# Altium project LMAT_AMT_MAG_V1.PrjPcb
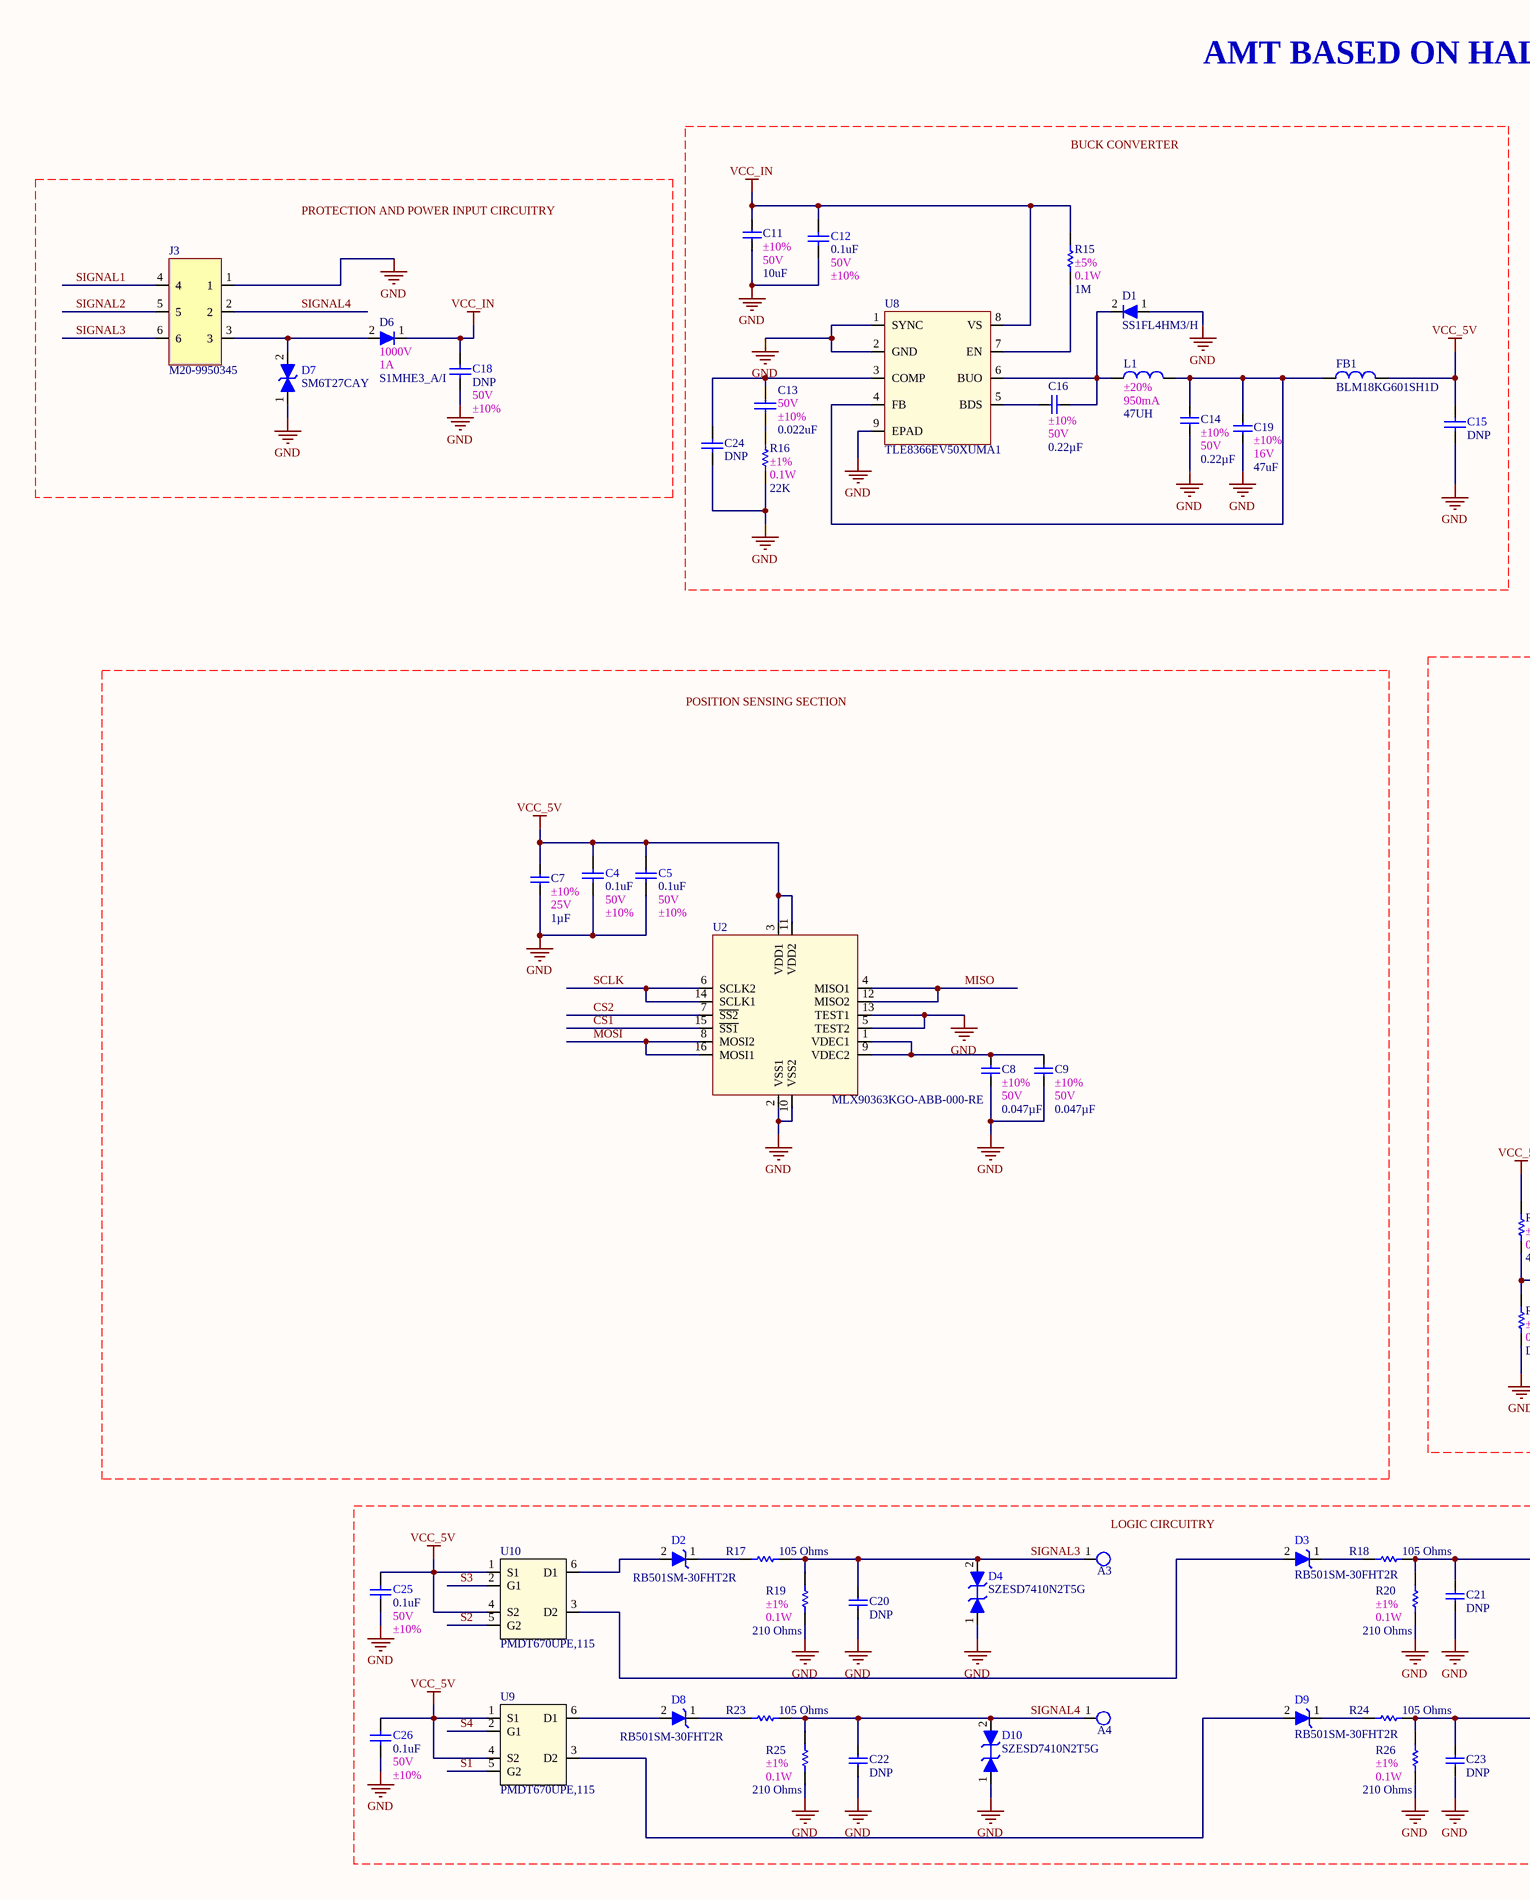
[diagram p0: LMAT_AMT_MAG__V1.SchDoc, left]
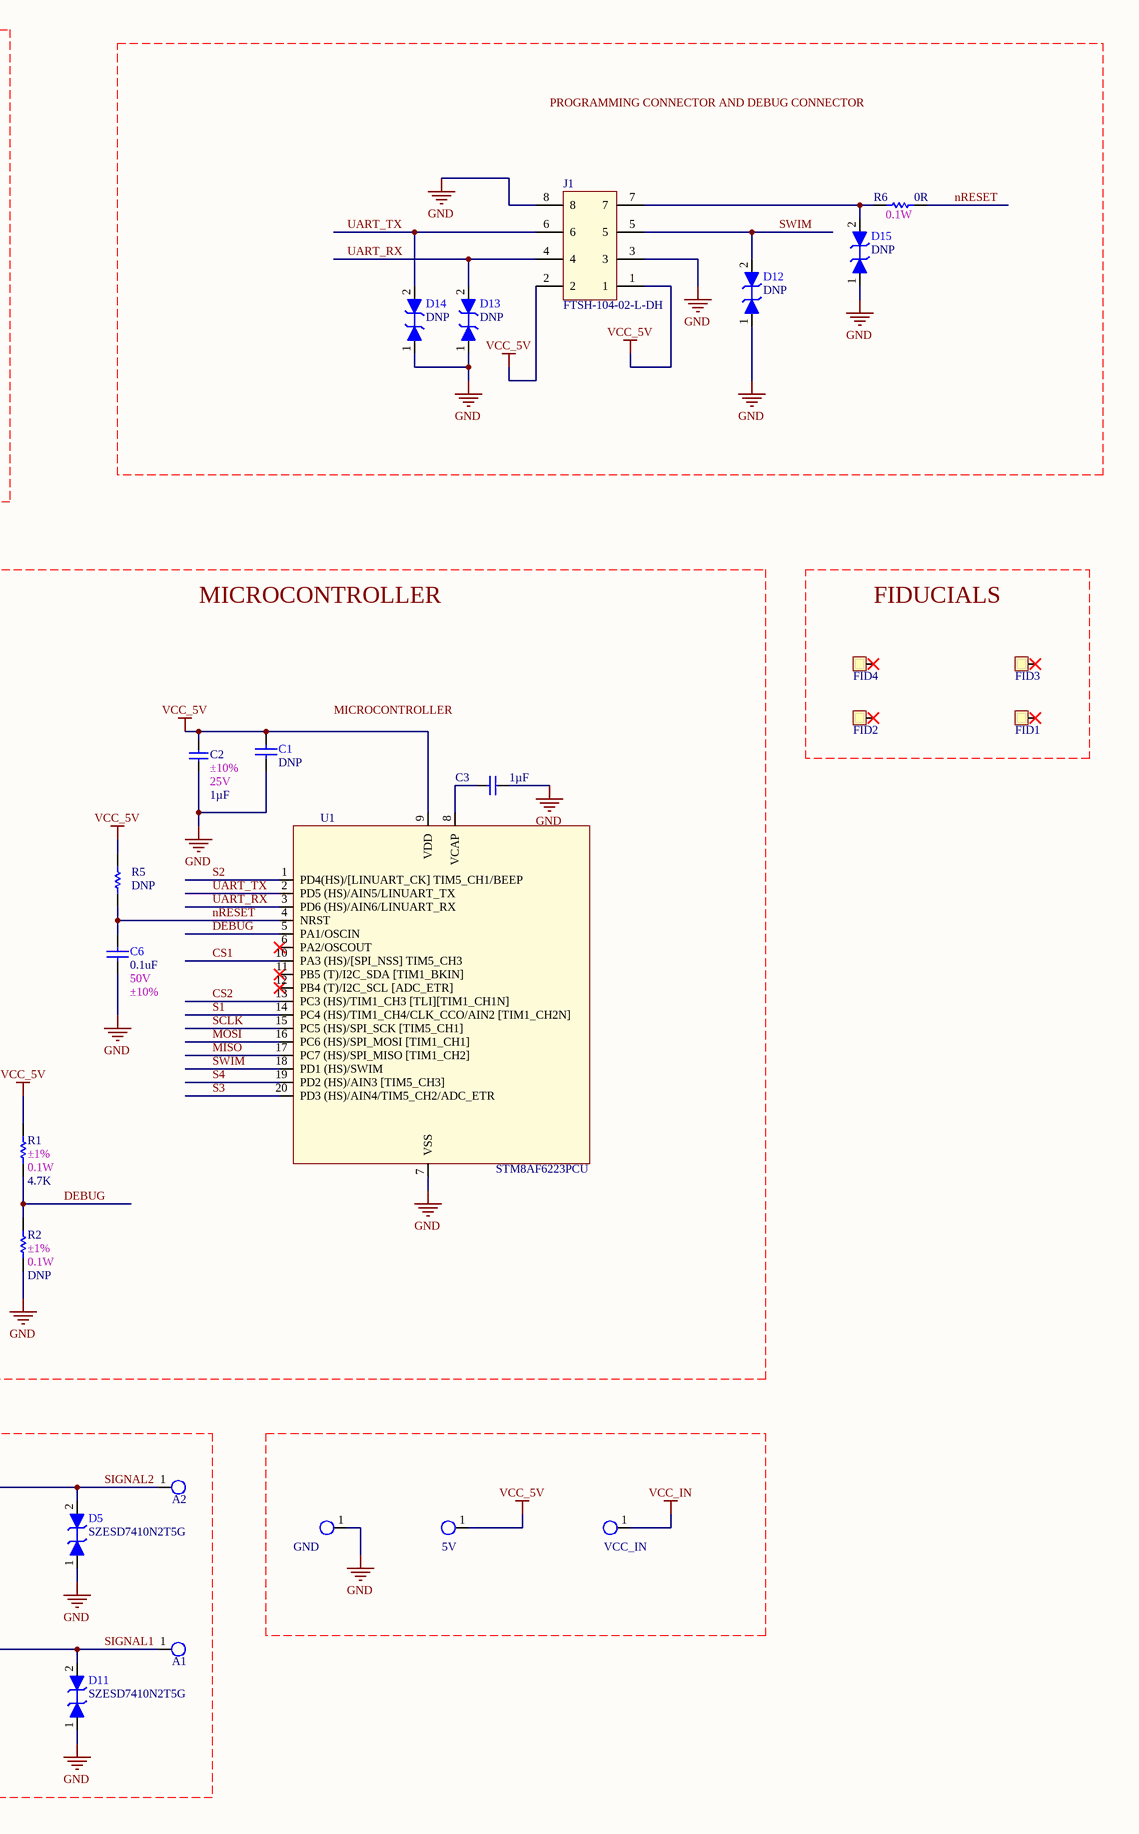
[diagram p1: LMAT_AMT_MAG__V1.SchDoc, right]
1 sheet, 73 parts. Net scope: global (net labels, ports and power ports of the same name join across sheets).
Board file: LMAT_AMT_MAG_V1.PcbDoc

## Sheet LMAT_AMT_MAG__V1.SchDoc
size C

### Parts
5V  Test Point- 35mil  [TP_35M_DIA]  (value not drawn)
A1  Test Point- 35mil  [TP_35M_DIA]  (value not drawn)
A2  Test Point- 35mil  [TP_35M_DIA]  (value not drawn)
A3  Test Point- 35mil  [TP_35M_DIA]  (value not drawn)
A4  Test Point- 35mil  [TP_35M_DIA]  (value not drawn)
C1  value DNP  [SMDC0603]  (hidden comment: CAP CER 0.1UF 50V 10% X7R 0603)
C2  value 1µF  2nd Auxiliary Field: ±10%  1st Auxiliary Field: 25V  [SMDC0603]  (hidden comment: CAP CER 1UF 25V X7R 0603)
C3  value 1µF  [SMDC0603]  (hidden comment: CAP CER 1UF 25V X7R 0603)
C4  value 0.1uF  1st Auxiliary Field: 50V  2nd Auxiliary Field: ±10%  [SMDC0603]  (hidden comment: CAP CER 0.1UF 50V 10% X7R 0603)
C5  value 0.1uF  1st Auxiliary Field: 50V  2nd Auxiliary Field: ±10%  [SMDC0603]  (hidden comment: CAP CER 0.1UF 50V 10% X7R 0603)
C6  value 0.1uF  1st Auxiliary Field: 50V  2nd Auxiliary Field: ±10%  [SMDC0603]  (hidden comment: CAP CER 0.1UF 50V 10% X7R 0603)
C7  value 1µF  2nd Auxiliary Field: ±10%  1st Auxiliary Field: 25V  [SMDC0603]  (hidden comment: CAP CER 1UF 25V X7R 0603)
C8  value 0.047µF  2nd Auxiliary Field: ±10%  1st Auxiliary Field: 50V  [SMDC0603]  (hidden comment: CAP CER 0.047UF 50V X7R 0603)
C9  value 0.047µF  2nd Auxiliary Field: ±10%  1st Auxiliary Field: 50V  [SMDC0603]  (hidden comment: CAP CER 0.047UF 50V X7R 0603)
C11  value 10uF  2nd Auxiliary Field: ±10%  1st Auxiliary Field: 50V  [SMDC1210]  (hidden comment: CAP CER 10UF 50V X7R 1210)
C12  value 0.1uF  1st Auxiliary Field: 50V  2nd Auxiliary Field: ±10%  [SMDC0603]  (hidden comment: CAP CER 0.1UF 50V 10% X7R 0603)
C13  value 0.022uF  1st Auxiliary Field: 50V  2nd Auxiliary Field: ±10%  [SMDC0603]  (hidden comment: CAP CER 0.022UF 50V 10% X7R 0603)
C14  value 0.22µF  2nd Auxiliary Field: ±10%  1st Auxiliary Field: 50V  [SMDC0603]  (hidden comment: CAP CER 0.22UF 50V X7R 0603)
C15  value DNP  [SMDC0603]  (hidden comment: CAP CER 0.1UF 50V 10% X7R 0603)
C16  value 0.22µF  2nd Auxiliary Field: ±10%  1st Auxiliary Field: 50V  [SMDC0603]  (hidden comment: CAP CER 0.22UF 50V X7R 0603)
C18  value DNP  1st Auxiliary Field: 50V  2nd Auxiliary Field: ±10%  [SMDC0603]  (hidden comment: CAP CER 0.1UF 50V 10% X7R 0603)
C19  value 47uF  2nd Auxiliary Field: ±10%  1st Auxiliary Field: 16V  [SMDC1210]  (hidden comment: CAP CER 47UF 16V X6S 1210)
C20  value DNP  [SMDC0603]  (hidden comment: CAP CER 10000PF 50V X8R 0603)
C21  value DNP  [SMDC0603]  (hidden comment: CAP CER 10000PF 50V X8R 0603)
C22  value DNP  [SMDC0603]  (hidden comment: CAP CER 10000PF 50V X8R 0603)
C23  value DNP  [SMDC0603]  (hidden comment: CAP CER 10000PF 50V X8R 0603)
C24  value DNP  [SMDC0603]  (hidden comment: CAP CER 0.022UF 50V 10% X7R 0603)
C25  value 0.1uF  1st Auxiliary Field: 50V  2nd Auxiliary Field: ±10%  [SMDC0603]  (hidden comment: CAP CER 0.1UF 50V 10% X7R 0603)
C26  value 0.1uF  1st Auxiliary Field: 50V  2nd Auxiliary Field: ±10%  [SMDC0603]  (hidden comment: CAP CER 0.1UF 50V 10% X7R 0603)
D1  value SS1FL4HM3/H  [SODFL370X110-2N]  (hidden comment: DIODE SCHOTTKY 40V 1A DO-219AB)
D2  value RB501SM-30FHT2R  [SOD1700X70N-V2]  (hidden comment: Diode Schottky 30V 100mA Surface Mount EMD2)
D3  value RB501SM-30FHT2R  [SOD1700X70N-V2]  (hidden comment: Diode Schottky 30V 100mA Surface Mount EMD2)
D4  value SZESD7410N2T5G  [DFN65P100X65X45-2N]  (hidden comment: TVS DIODE 5.5V 14V 2X1SON)
D5  value SZESD7410N2T5G  [DFN65P100X65X45-2N]  (hidden comment: TVS DIODE 5.5V 14V 2X1SON)
D6  value S1MHE3_A/I  1st Auxiliary Field: 1000V  2nd Auxiliary Field: 1A  [DIOM4227X23N-2N]  (hidden comment: DIODE GEN PURP 1KV 1A DO214AC)
D7  value SM6T27CAY  [DIOM4336X26B]  (hidden comment: TVS DIODE 23.1V 48.3V SMB)
D8  value RB501SM-30FHT2R  [SOD1700X70N-V2]  (hidden comment: Diode Schottky 30V 100mA Surface Mount EMD2)
D9  value RB501SM-30FHT2R  [SOD1700X70N-V2]  (hidden comment: Diode Schottky 30V 100mA Surface Mount EMD2)
D10  value SZESD7410N2T5G  [DFN65P100X65X45-2N]  (hidden comment: TVS DIODE 5.5V 14V 2X1SON)
D11  value SZESD7410N2T5G  [DFN65P100X65X45-2N]  (hidden comment: TVS DIODE 5.5V 14V 2X1SON)
D12  value DNP  [DFN65P100X65X45-2N]  (hidden comment: TVS DIODE 5.5V 14V 2X1SON)
D13  value DNP  [DFN65P100X65X45-2N]  (hidden comment: TVS DIODE 5.5V 14V 2X1SON)
D14  value DNP  [DFN65P100X65X45-2N]  (hidden comment: TVS DIODE 5.5V 14V 2X1SON)
D15  value DNP  [DFN65P100X65X45-2N]  (hidden comment: TVS DIODE 5.5V 14V 2X1SON)
FB1  value BLM18KG601SH1D  [SMDL0603]  (hidden comment: FERRITE BEAD 600 OHM 0603 1LN)
FID1  FID40X40  [FID40X40]  (value not drawn)
FID2  FID40X40  [FID40X40]  (value not drawn)
FID3  FID40X40  [FID40X40]  (value not drawn)
FID4  FID40X40  [FID40X40]  (value not drawn)
GND  Test Point- 35mil  [TP_35M_DIA]  (value not drawn)
J1  Manufacturer Part Number: FTSH-104-02-L-DH  [HDRRA8W53P127_2X4_9754X251X343P]  (hidden comment: CONN HEADER R/A 6POS 2.54MMCONN HEADER SMD R/A 8POS 1.27MM)
J3  Manufacturer Part Number: M20-9950345  [HDRRA6W86P254_2X3_1344X254X528P]  (hidden comment: CONN HEADER R/A 6POS 2.54MM)
L1  value 47UH  2nd Auxiliary Field: ±20%  1st Auxiliary Field: 950mA  [INDC4949X310N]  (hidden comment: FIXED IND 47UH 700MA 422.5 MOHM)
R1  value 4.7K  2nd Auxiliary Field: ±1%  1st Auxiliary Field: 0.1W  [SMDR0402]  (hidden comment: RES SMD 4.7K OHM 1% 1/10W 0402)
R2  value DNP  2nd Auxiliary Field: ±1%  1st Auxiliary Field: 0.1W  [SMDR0402]  (hidden comment: RES SMD 4.7K OHM 1% 1/10W 0402)
R5  value DNP  [SMDR0603]  (hidden comment: RES SMD 47K OHM 1% 1/10W 0603)
R6  value 0R  1st Auxiliary Field: 0.1W  [SMDR0603]  (hidden comment: RES SMD 0.0OHM JUMPER 1/10W 0603)
R15  value 1M  2nd Auxiliary Field: ±5%  1st Auxiliary Field: 0.1W  [SMDR0603]  (hidden comment: RES SMD 1M OHM 5% 1/10W 0603)
R16  value 22K  2nd Auxiliary Field: ±1%  1st Auxiliary Field: 0.1W  [SMDR0603]  (hidden comment: RES SMD 22K OHM 1% 1/10W 0603)
R17  value 105 Ohms  [SMDR0603]  (hidden comment: RES SMD 105 OHM 1% 1/10W 0603)
R18  value 105 Ohms  [SMDR0603]  (hidden comment: RES SMD 105 OHM 1% 1/10W 0603)
R19  value 210 Ohms  2nd Auxiliary Field: ±1%  1st Auxiliary Field: 0.1W  [SMDR0603]  (hidden comment: RES SMD 210 OHM 1% 1/10W 0603)
R20  value 210 Ohms  2nd Auxiliary Field: ±1%  1st Auxiliary Field: 0.1W  [SMDR0603]  (hidden comment: RES SMD 210 OHM 1% 1/10W 0603)
R23  value 105 Ohms  [SMDR0603]  (hidden comment: RES SMD 105 OHM 1% 1/10W 0603)
R24  value 105 Ohms  [SMDR0603]  (hidden comment: RES SMD 105 OHM 1% 1/10W 0603)
R25  value 210 Ohms  2nd Auxiliary Field: ±1%  1st Auxiliary Field: 0.1W  [SMDR0603]  (hidden comment: RES SMD 210 OHM 1% 1/10W 0603)
R26  value 210 Ohms  2nd Auxiliary Field: ±1%  1st Auxiliary Field: 0.1W  [SMDR0603]  (hidden comment: RES SMD 210 OHM 1% 1/10W 0603)
U1  value STM8AF6223PCU  [SOP65P640X120-20N]  (hidden comment: IC MCU 8BIT 8KB FLASH 20TSSOP)
U2  value MLX90363KGO-ABB-000-RE  [SOP65P640X120-16N]  (hidden comment: SENSOR HALL EFFECT SPI 16TSSOP)
U8  value TLE8366EV50XUMA1  [SOIC127P600X170_HS-9N]  (hidden comment: IC REG BUCK 5V 1.8A 8DSO)
U9  value PMDT670UPE,115  [SOTFL50P160X60-6N]  (hidden comment: MOSFET 2P-CH 20V 0.55A SOT666)
U10  value PMDT670UPE,115  [SOTFL50P160X60-6N]  (hidden comment: MOSFET 2P-CH 20V 0.55A SOT666)
VCC_IN  Test Point- 35mil  [TP_35M_DIA]  (value not drawn)

### Nets
GND: C1.2 C2.1 C3.2 C4.2 C5.2 C6.2 C7.1 C8.1 C9.1 C11.1 C12.2 C14.1 C15.2 C18.2 C19.1 C20.1 C21.1 C22.1 C23.1 C24.2 C25.2 C26.2 D1.1(Cathode) D4.1(ANODE) D5.1(ANODE) D7.1(ANODE) D10.1(ANODE) D11.1(ANODE) D12.1(ANODE) D13.1(ANODE) D14.1(ANODE) D15.1(ANODE) GND.1 J1.3 J1.8 J3.1 R2.1 R16.1 R19.2 R20.2 R25.2 R26.2 U1.7(VSS) U2.2(VSS1) U2.5(TEST2) U2.10(VSS2) U2.13(TEST1) U8.1(SYNC) U8.2(GND) U8.9(EPAD)
VCC_5V: 5V.1 C1.1 C2.2 C4.1 C5.1 C7.2 C15.1 C25.1 C26.1 FB1.2 J1.1 J1.2 R1.2 R5.2 U1.9(VDD) U2.3(VDD1) U2.11(VDD2) U9.1(S1) U9.4(S2) U10.1(S1) U10.4(S2)
VCC_IN: C11.2 C12.1 C18.1 D6.1(Cathode) R15.2 U8.8(VS) VCC_IN.1
CS1: U1.10(PA3_(HS)/[SPI_NSS]_TIM5_CH3) U2.15(~{SS1})
CS2: U1.13(PC3_(HS)/TIM1_CH3_[TLI][TIM1_CH1N]) U2.7(~{SS2})
DEBUG: R1.1 R2.2 U1.5(PA1/OSCIN)
MISO: U1.17(PC7_(HS)/SPI_MISO_[TIM1_CH2]) U2.4(MISO1) U2.12(MISO2)
MOSI: U1.16(PC6_(HS)/SPI_MOSI_[TIM1_CH1]) U2.8(MOSI2) U2.16(MOSI1)
nRESET: C6.1 R5.1 R6.2 U1.4(NRST)
S1: U1.14(PC4_(HS)/TIM1_CH4/CLK_CCO/AIN2_[TIM1_CH2N]) U9.5(G2)
S2: U1.1(PD4(HS)/[LINUART_CK]_TIM5_CH1/BEEP) U10.5(G2)
S3: U1.20(PD3_(HS)/AIN4/TIM5_CH2/ADC_ETR) U10.2(G1)
S4: U1.19(PD2_(HS)/AIN3_[TIM5_CH3]) U9.2(G1)
SCLK: U1.15(PC5_(HS)/SPI_SCK_[TIM5_CH1]) U2.6(SCLK2) U2.14(SCLK1)
SIGNAL1: A1.1 C23.2 D11.2(CATHODE) J3.4 R24.2 R26.1
SIGNAL2: A2.1 C21.2 D5.2(CATHODE) J3.5 R18.2 R20.1
SIGNAL3: A3.1 C20.2 D4.2(CATHODE) J3.6 R17.2 R19.1
SIGNAL4: A4.1 C22.2 D10.2(CATHODE) J3.2 R23.2 R25.1
SWIM: D12.2(CATHODE) J1.5 U1.18(PD1_(HS)/SWIM)
UART_RX: D13.2(CATHODE) J1.4 U1.3(PD6_(HS)/AIN6/LINUART_RX)
UART_TX: D14.2(CATHODE) J1.6 U1.2(PD5_(HS)/AIN5/LINUART_TX)
NetC3_1: C3.1 U1.8(VCAP)
NetC8_2: C8.2 C9.2 U2.1(VDEC1) U2.9(VDEC2)
NetC13_1: C13.1 C24.1 U8.3(COMP)
NetC13_2: C13.2 R16.2
NetC14_2: C14.2 C19.2 FB1.1 L1.2 U8.4(FB)
NetC16_1: C16.1 U8.5(BDS)
NetC16_2: C16.2 D1.2(Anode) L1.1 U8.6(BUO)
NetD2_1: D2.1(CATHODE) R17.1
NetD2_2: D2.2(ANODE) U10.6(D1)
NetD3_1: D3.1(CATHODE) R18.1
NetD3_2: D3.2(ANODE) U10.3(D2)
NetD6_2: D6.2(Anode) D7.2(CATHODE) J3.3
NetD8_1: D8.1(CATHODE) R23.1
NetD8_2: D8.2(ANODE) U9.6(D1)
NetD9_1: D9.1(CATHODE) R24.1
NetD9_2: D9.2(ANODE) U9.3(D2)
NetD15_2: D15.2(CATHODE) J1.7 R6.1
NetR15_1: R15.1 U8.7(EN)

Not connected (* = marked no-connect by the designer): FID1 0*; FID2 0*; FID3 0*; FID4 0*; U1 6(PA2/OSCOUT)* 11(PB5_(T)/I2C_SDA_[TIM1_BKIN])* 12(PB4_(T)/I2C_SCL_[ADC_ETR])*

### Notes on the sheet
- AMT BASED ON HALL EFFECT SENSOR
- BUCK CONVERTER
- PROTECTION AND POWER INPUT CIRCUITRY
- PROGRAMMING CONNECTOR AND DEBUG CONNECTOR
- MICROCONTROLLER
- FIDUCIALS
- POSITION SENSING SECTION
- (near A3) LOGIC CIRCUITRY

### Library data of the parts
5V A1-A4 GND VCC_IN = EMS-TP35MIL-S: Internal Part Number: EMS-TP35MIL-S; Component Height (mm): *; Part Type: Test Point- 35mil; Vendor Name: *
C1 C4-C6 C12 C15 C18 C25 C26 = ECA0U10K50V0-SC: Manufacturer Part Number: CGA3E2X7R1H104K080AA; Manufacturer: TDK Corporation; Vendor Part Number: 445-5666-1-ND; 3rd Auxiliary Field: RoHS Compliant; Component Height (mm): 0.90mm; Vendor Name: Digi-Key; Internal Part Number: ECA0U10K50V0-SC; Part Type: CAP CER 0.1UF 50V X7R 0603; Temp Co: X7R
  C1 C15: 1st Auxiliary Field: 50V; 2nd Auxiliary Field: ±10%
C2 C7 = ECA1U00L25V0-SC: Manufacturer: TDK Corporation; Vendor Part Number: 445-173628-1-ND; Manufacturer Part Number: CGA3E1X7R1E105K080AE; Vendor Name: Digi-Key; 3rd Auxiliary Field: RoHS Compliant; Component Height (mm): 0.95mm; Temp Co: -55°C ~ 125°C; Part Type: CAP CER 1UF 25V X7R 0603; Internal Part Number: ECA1U00L25V0-SC; 4th Auxiliary Field: *
C3 = ECA1U00L25V0-SC: Manufacturer: TDK Corporation; Vendor Part Number: 445-173628-1-ND; Manufacturer Part Number: CGA3E1X7R1E105K080AE; Vendor Name: Digi-Key; 3rd Auxiliary Field: RoHS Compliant; Component Height (mm): 0.95mm; Temp Co: -55°C ~ 125°C; 2nd Auxiliary Field: ±10%; Part Type: CAP CER 1UF 25V X7R 0603; Internal Part Number: ECA1U00L25V0-SC; 4th Auxiliary Field: *; 1st Auxiliary Field: 25V
C8 C9 = ECA47N0L50V-SC: Manufacturer: TDK Corporation; Vendor Part Number: 445-5664-1-ND; Manufacturer Part Number: CGA3E2X7R1H473K080AA; Vendor Name: Digi-Key; 3rd Auxiliary Field: RoHS Compliant; Component Height (mm): 0.9mm; Temp Co: -55°C ~ 125°C; Part Type: CAP CER 0.047UF 50V X7R 0603; Internal Part Number: ECA47N0L50V-SC; 4th Auxiliary Field: *
C11 = ECA10U0L50V0-SH: Manufacturer: Taiyo Yuden; Vendor Part Number: 587-6026-1-ND; Manufacturer Part Number: UMJ325KB7106KMHP; Vendor Name: Digi-Key; 3rd Auxiliary Field: RoHS Compliant; 4th Auxiliary Field: AEC-Q200; Component Height (mm): 2.80mm; Temp Co: -55°C ~ 125°C; Part Type: CAP CER 10UF 50V X7R 1210; Internal Part Number: ECA10U0L50V0-SH
C13 C24 = ECA0U022K50V0-SC: Manufacturer Part Number: CGA3E2X7R1H223K080AA; Manufacturer: TDK Corporation; Vendor Part Number: 445-5663-1-ND; Vendor Name: Digi-Key; Component Height (mm): 0.90mm; Internal Part Number: ECA0U022K50V0-SC; Part Type: CAP CER 0.022UF 50V X7R 0603; Temp Co: X7R
  C24: 1st Auxiliary Field: 50V; 2nd Auxiliary Field: ±10%
C14 C16 = ECA0U22L50V0-SC: Manufacturer: Murata Electronics North America; Vendor Part Number: 490-14410-1-ND; Manufacturer Part Number: GCJ188R71H224KA01D; Vendor Name: Digi-Key; 3rd Auxiliary Field: RoHS Compliant; Component Height (mm): 0.90mm; Temp Co: -55°C ~ 125°C; Part Type: CAP CER 0.22UF 50V X7R 0603; Internal Part Number: ECA0U22L50V0-SC; 4th Auxiliary Field: *
C19 = ECA47U0L16V0-SH: Manufacturer: Murata Electronics North America; Vendor Part Number: 490-12494-1-ND; Manufacturer Part Number: GRT32EC81C476KE13L; Vendor Name: Digi-Key; 3rd Auxiliary Field: RoHS Compliant; 4th Auxiliary Field: AEC-Q200; Component Height (mm): 2.70mm; Temp Co: -55°C ~ 105°C; Part Type: CAP CER 47UF 16V X6S 1210; Internal Part Number: ECA47U0L16V0-SH
C20-C23 = ECA0U01L50V0-SC: Manufacturer: TDK Corporation; Vendor Part Number: 445-5892-1-ND; Manufacturer Part Number: CGA3E2X8R1H103K080AA; Vendor Name: Digi-Key; 3rd Auxiliary Field: RoHS Compliant; 4th Auxiliary Field: AEC-Q200; Component Height (mm): 0.80mm; Temp Co: -55°C ~ 150°C; 2nd Auxiliary Field: ±10%; Part Type: CAP CER 10000PF 50V X8R 0603; Internal Part Number: ECA0U01L50V0-SC; 1st Auxiliary Field: 50V
D1 = EDDVS1A0040V0-S: Manufacturer: Vishay Semiconductor Diodes Division; Vendor Part Number: SS1FL4HM3/HGICT-ND; 3rd Auxiliary Field: RoHS Compliant; Temp Co: -55°C ~ 150°C; Vendor Name: Digi-Key; Component Height (mm): 1.08mm; Manufacturer Part Number: SS1FL4HM3/H; Internal Part Number: EDDVS1A0040V0-S; Part Type: DIODE SCHOTTKY 40V 1A DO-219AB; 4th Auxiliary Field: *; 1st Auxiliary Field: 40V; 2nd Auxiliary Field: 1A
D2 D3 D8 D9 = EDDR0A1030V0-S: Manufacturer: Rohm Semiconductor; Vendor Part Number: RB501SM-30FHT2RCT-ND; 3rd Auxiliary Field: RoHS Compliant; Component Height (mm): 0.70mm; Temp Co: 125°C (Max); Vendor Name: Digi-Key; Manufacturer Part Number: RB501SM-30FHT2R; Internal Part Number: EDDR0A1030V0-S; Part Type: Diode Schottky 30V 100mA Surface Mount EMD2; 4th Auxiliary Field: *; 2nd Auxiliary Field: 100mA; 1st Auxiliary Field: 30V
D4 D5 D10 D11 = EDDOS16A010V0-S: TVS DIODE 8V 20V 2X2DFN; Manufacturer: ON Semiconductor; Vendor Part Number: SZESD7410N2T5GOSCT-ND; 3rd Auxiliary Field: RoHS Compliant; Component Height (mm): 0.40mm; Temp Co: -55°C ~ 150°C (TJ); 4th Auxiliary Field: AEC-Q101; Vendor Name: Digi-Key; 2nd Auxiliary Field: 16A; 1st Auxiliary Field: 10V; Manufacturer Part Number: SZESD7410N2T5G; Internal Part Number: EDDOS16A010V0-S; Part Type: TVS DIODE 8V 20V 2X2DFN
D6 = EDDVS1A001000V-S: Manufacturer: Vishay Semiconductor Diodes Division; Vendor Part Number: S1MHE3_A/IGICT-ND; 3rd Auxiliary Field: RoHS Compliant; Temp Co: -55°C ~ 150°C; Vendor Name: Digi-Key; Component Height (mm): 2.29mm; Manufacturer Part Number: S1MHE3_A/I; Internal Part Number: EDDVS1A001000V-S; Part Type: DIODE GEN PURP 1KV 1A DO214AC; 4th Auxiliary Field: *
D7 = EDDST83A025V7-S: Manufacturer: STMicroelectronics; Vendor Part Number: 497-10798-1-ND; 3rd Auxiliary Field: RoHS Compliant; Component Height (mm): 2.65mm; Temp Co: -55°C ~ 150°C (TJ); Vendor Name: Digi-Key; 2nd Auxiliary Field: 600W; 1st Auxiliary Field: 25.7V; Manufacturer Part Number: SM6T27CAY; Internal Part Number: EDDST83A025V7-S; Part Type: TVS DIODE 23.1V 48.3V SMB; 4th Auxiliary Field: *
D12-D15 = EDDOS16A010V0-S: TVS DIODE 8V 20V 2X2DFN; Manufacturer Part Number: SZESD7410N2T5G; Manufacturer: ON Semiconductor; Vendor Part Number: SZESD7410N2T5GOSCT-ND; 3rd Auxiliary Field: RoHS Compliant; Component Height (mm): 0.40mm; Temp Co: -55°C ~ 150°C (TJ); 4th Auxiliary Field: AEC-Q101; Vendor Name: Digi-Key; 2nd Auxiliary Field: 16A; 1st Auxiliary Field: 10V; Internal Part Number: EDDOS16A010V0-S; Part Type: TVS DIODE 8V 20V 2X2DFN
FB1 = EIN600R1A30-S: Manufacturer: Murata Electronics North America; Vendor Part Number: 490-13259-1-ND; Vendor Name: Digi-Key; 3rd Auxiliary Field: RoHS Compliant; 4th Auxiliary Field: AEC-Q200; Component Height (mm): 0.95mm; Temp Co: -55°C ~ 125°C; 2nd Auxiliary Field: 1.3A; 1st Auxiliary Field: 150 mOhm; Part Type: FERRITE BEAD 600 OHM 0603 1LN; Manufacturer Part Number: BLM18KG601SH1D; Internal Part Number: EIN600R1A30-S
FID1-FID4 = FID_40X40
J1 = ECN-FTSH-104-02-L-DH-0005: CONN HEADER SMD R/A 8POS 1.27MM; Manufacturer: Samtec Inc.; Vendor Part Number: SAM11248-ND; 2nd Auxiliary Field: 2 rows; 3rd Auxiliary Field: RoHS Compliant; Component Height (mm): 3.43mm; Temp Co: -55°C ~ 125°C; Vendor Name: Digi-Key; 1st Auxiliary Field: 8POS; Internal Part Number: ECN-FTSH-104-02-L-DH-0005; Part Type: CONN HEADER SMD R/A 8POS 1.27MM; Value: FTSH-104-02-L-DH; 4th Auxiliary Field: *
J3 = ECN-M20-9950345-0003: Manufacturer: Harwin Inc.; Vendor Part Number: 952-2092-ND; 2nd Auxiliary Field: 2 rows; 3rd Auxiliary Field: RoHS Compliant; Component Height (mm): 5.08mm; Temp Co: -40°C ~ 105°C; Vendor Name: Digi-Key; 1st Auxiliary Field: 6pos; Internal Part Number: ECN-M20-9950345-0003; Part Type: CONN HEADER R/A 6POS 2.54MM; Value: M20-9950345; 4th Auxiliary Field: *
L1 = EIN47U0N950M-S: Manufacturer: Taiyo Yuden; Vendor Part Number: 587-3604-1-ND; Manufacturer Part Number: NRS5030T470MMGJV; Vendor Name: Digi-Key; 3rd Auxiliary Field: RoHS Compliant; 4th Auxiliary Field: AEC-Q200; Component Height (mm): 3.00mm; Temp Co: -40°C ~ 125°C; Part Type: FIXED IND 47UH 700MA 422.5 MOHM; Internal Part Number: EIN47U0N950M-S
R1 R2 = ERE4K70G110-SB: Manufacturer: Panasonic Electronic Components; Vendor Part Number: P4.70KLCT-ND; Manufacturer Part Number: ERJ-2RKF4701X; Alternate Part Number: RK73H1ETTP4701F; Vendor Name: Digi-Key; 3rd Auxiliary Field: RoHS Compliant; 4th Auxiliary Field: AEC-Q200; Component Height (mm): 0.40mm; Temp Co: ±100ppm/°C; Part Type: RES SMD 4.7K OHM 1% 1/10W 0402; Internal Part Number: ERE4K70G110-SB
R5 = ERE47K0G110-SC: Manufacturer: Yageo; Vendor Part Number: YAG2129CT-ND; Manufacturer Part Number: AT0603FRE0747KL; Vendor Name: Digi-Key; 3rd Auxiliary Field: RoHS Compliant; Component Height (mm): 0.55mm; Temp Co: -55°C ~ 155°C; 1st Auxiliary Field: 0.1W; Part Type: RES SMD 47K OHM 1% 1/10W 0603; Internal Part Number: ERE47K0G110-SC; 4th Auxiliary Field: *; 2nd Auxiliary Field: ±1%
R6 = ERE0R00110-SC: Manufacturer Part Number: ERJ-3GEY0R00V; Manufacturer: Panasonic Electronic Components; Vendor Part Number: P0.0GCT-ND; Component Height (mm): 0.55mm; Vendor Name: Digi-Key; Internal Part Number: ERE0R00110-SC; Part Type: RES SMD 0.0OHM JUMPER 1/10W 0603; Temp Co: *; 2nd Auxiliary Field: Jumper
R15 = ERE1M00K110-SC: Manufacturer: Vishay Dale; Vendor Part Number: 541-2216-1-ND; Manufacturer Part Number: RCA06031M00JNEA; Vendor Name: Digi-Key; 3rd Auxiliary Field: RoHS Compliant; 4th Auxiliary Field: AEC-Q200; Component Height (mm): 0.50mm; Temp Co: -55°C ~ 155°C; Part Type: RES SMD 1M OHM 5% 1/10W 0603; Internal Part Number: ERE1M00K110-SC
R16 = ERE22K0G110-SC: Manufacturer: Panasonic Electronic Components; Vendor Part Number: P22.0KHCT-ND; Manufacturer Part Number: ERJ-3EKF2202V; Vendor Name: Digi-Key; 3rd Auxiliary Field: RoHS Compliant; 4th Auxiliary Field: AEC-Q200; Component Height (mm): 0.55mm; Temp Co: -55°C ~ 155°C; Part Type: RES SMD 22K OHM 1% 1/10W 0603; Internal Part Number: ERE22K0G110-SC
R17 R18 R23 R24 = ERE105RG110-SC: Manufacturer: Panasonic Electronic Components; Vendor Part Number: P105HCT-ND; Manufacturer Part Number: ERJ-3EKF1050V; Vendor Name: Digi-Key; 3rd Auxiliary Field: RoHS Compliant; 4th Auxiliary Field: AEC-Q200; Component Height (mm): 0.55mm; Temp Co: -55°C ~ 155°C; 1st Auxiliary Field: 0.1W; Part Type: RES SMD 105 OHM 1% 1/10W 0603; Internal Part Number: ERE105RG110-SC; 2nd Auxiliary Field: ±1%
R19 R20 R25 R26 = ERE210RG110-SC: Manufacturer: Panasonic Electronic Components; Vendor Part Number: P210HCT-ND; Manufacturer Part Number: ERJ-3EKF2100V; Vendor Name: Digi-Key; 3rd Auxiliary Field: RoHS Compliant; 4th Auxiliary Field: AEC-Q200; Component Height (mm): 0.55mm; Temp Co: -55°C ~ 155°C; Part Type: RES SMD 210 OHM 1% 1/10W 0603; Internal Part Number: ERE210RG110-SC
U1 = EICSTMTSSOP-20-1691: Manufacturer: STMicroelectronics; Vendor Part Number: 497-17896-ND; Component Height (mm): 1.2mm; 3rd Auxiliary Field: RoHS Compliant; Vendor Name: Digi-Key; Temp Co: -40°C ~ 125°C (TA); 2nd Auxiliary Field: 8-Bit; 1st Auxiliary Field: 3V ~ 5.5V; Manufacturer Part Number: STM8AF6223PCU; Part Type: IC MCU 8BIT 8KB FLASH 20TSSOP; 4th Auxiliary Field: *; Internal Part Number: EICSTMTSSOP-20-1691
U2 = EICMTTSSOP-16-1690: Manufacturer: Melexis Technologies NV; Vendor Part Number: MLX90363KGO-ABB-000-RECT-ND; Component Height (mm): 1.1mm; 3rd Auxiliary Field: RoHS Compliant; Vendor Name: Digi-Key; Temp Co: -40°C ~ 125°C (TA); 2nd Auxiliary Field: 15.5mA; 1st Auxiliary Field: 4.5V ~ 5.5V; Manufacturer Part Number: MLX90363KGO-ABB-000-RE; Part Type: SENSOR HALL EFFECT SPI 16TSSOP; 4th Auxiliary Field: *; Internal Part Number: EICMTTSSOP-16-1690
U8 = EICITSOIC-08-0001: Manufacturer: Infineon Technologies; Vendor Part Number: TLE8366EV50XUMA1CT-ND; Component Height (mm): 1.7mm; 3rd Auxiliary Field: RoHS Compliant; 4th Auxiliary Field: AEC-Q100; Vendor Name: Digi-Key; Temp Co: -40°C ~ 150°C (TJ); 1st Auxiliary Field: 45V; Manufacturer Part Number: TLE8366EV50XUMA1; Part Type: IC REG BUCK 5V 1.8A 8DSO; Internal Part Number: EICITSOIC-08-0001; 2nd Auxiliary Field: 1.8A
U9 U10 = EICNUSOT666-06-0004: Manufacturer: Nexperia USA Inc.; Vendor Part Number: 1727-1334-1-ND; Component Height (mm): 0.6mm; 3rd Auxiliary Field: RoHS Compliant; 4th Auxiliary Field: AEC-Q101; Vendor Name: Digi-Key; Temp Co: -55°C ~ 150°C (TJ); 2nd Auxiliary Field: 550mA; Manufacturer Part Number: PMDT670UPE,115; Part Type: MOSFET 2P-CH 20V 0.55A SOT666; Internal Part Number: EICNUSOT666-06-0004; 1st Auxiliary Field: 20V